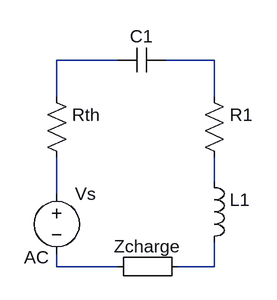
[diagram p0: schematic Draft6.asc]
Draft6.asc, the LTspice schematic file:
Version 4
SHEET 1 880 680
WIRE 144 16 64 16
WIRE 272 16 208 16
WIRE 64 64 64 16
WIRE 272 64 272 16
WIRE 272 176 272 144
WIRE 64 192 64 144
WIRE 64 288 64 272
WIRE 144 288 64 288
WIRE 272 288 272 256
WIRE 272 288 224 288
SYMBOL res 48 48 R0
SYMATTR InstName Rth
SYMATTR Value ""
SYMBOL res 256 48 R0
SYMATTR InstName R1
SYMATTR Value ""
SYMBOL cap 208 0 R90
WINDOW 0 0 32 VBottom 2
WINDOW 3 32 32 VTop 2
SYMATTR InstName C1
SYMATTR Value ""
SYMBOL ind 256 160 R0
SYMATTR InstName L1
SYMATTR Value ""
SYMBOL Misc\\EuropeanResistor 240 272 R90
WINDOW 0 5 56 VBottom 2
WINDOW 3 27 56 VTop 2
SYMATTR InstName Zcharge
SYMATTR Value ""
SYMBOL voltage 64 176 R0
WINDOW 3 -43 100 Left 2
WINDOW 123 0 0 Left 0
WINDOW 39 0 0 Left 0
SYMATTR InstName Vs
SYMATTR Value AC

The netlist it stands for:
* Draft6.asc
Rth N001 N004
R1 N002 N003
C1 N002 N001
L1 N003 N006
R§Zcharge N006 N005
Vs N004 N005 AC
.backanno
.end